# Altium project MGMEZZ04.PrjPCB (part 3 of 3)

## Sheet ADC.SchDoc
size Letter; Author: Adam Gilbert; CompanyName: McGill University; DrawnBy: Adam Gilbert; Organization: Altium Limited; Address1: McGill Cosmology; Address2: 3600 University Street; Address3: Montreal, Quebec; Address4: Canada; DocumentNumber: 5; Revision: Rev2; SheetNumber: 5; SheetTotal: 16; ProjectTitle: DfMux FMC Mezz; ModelNumber: MGMEZZ04; ProjectName: DfMux FMC Mezz
Used 2 times, as channels W12/DemodAB, W34/DemodAB. Parts and nets are listed once, with the designators drawn on the sheet.
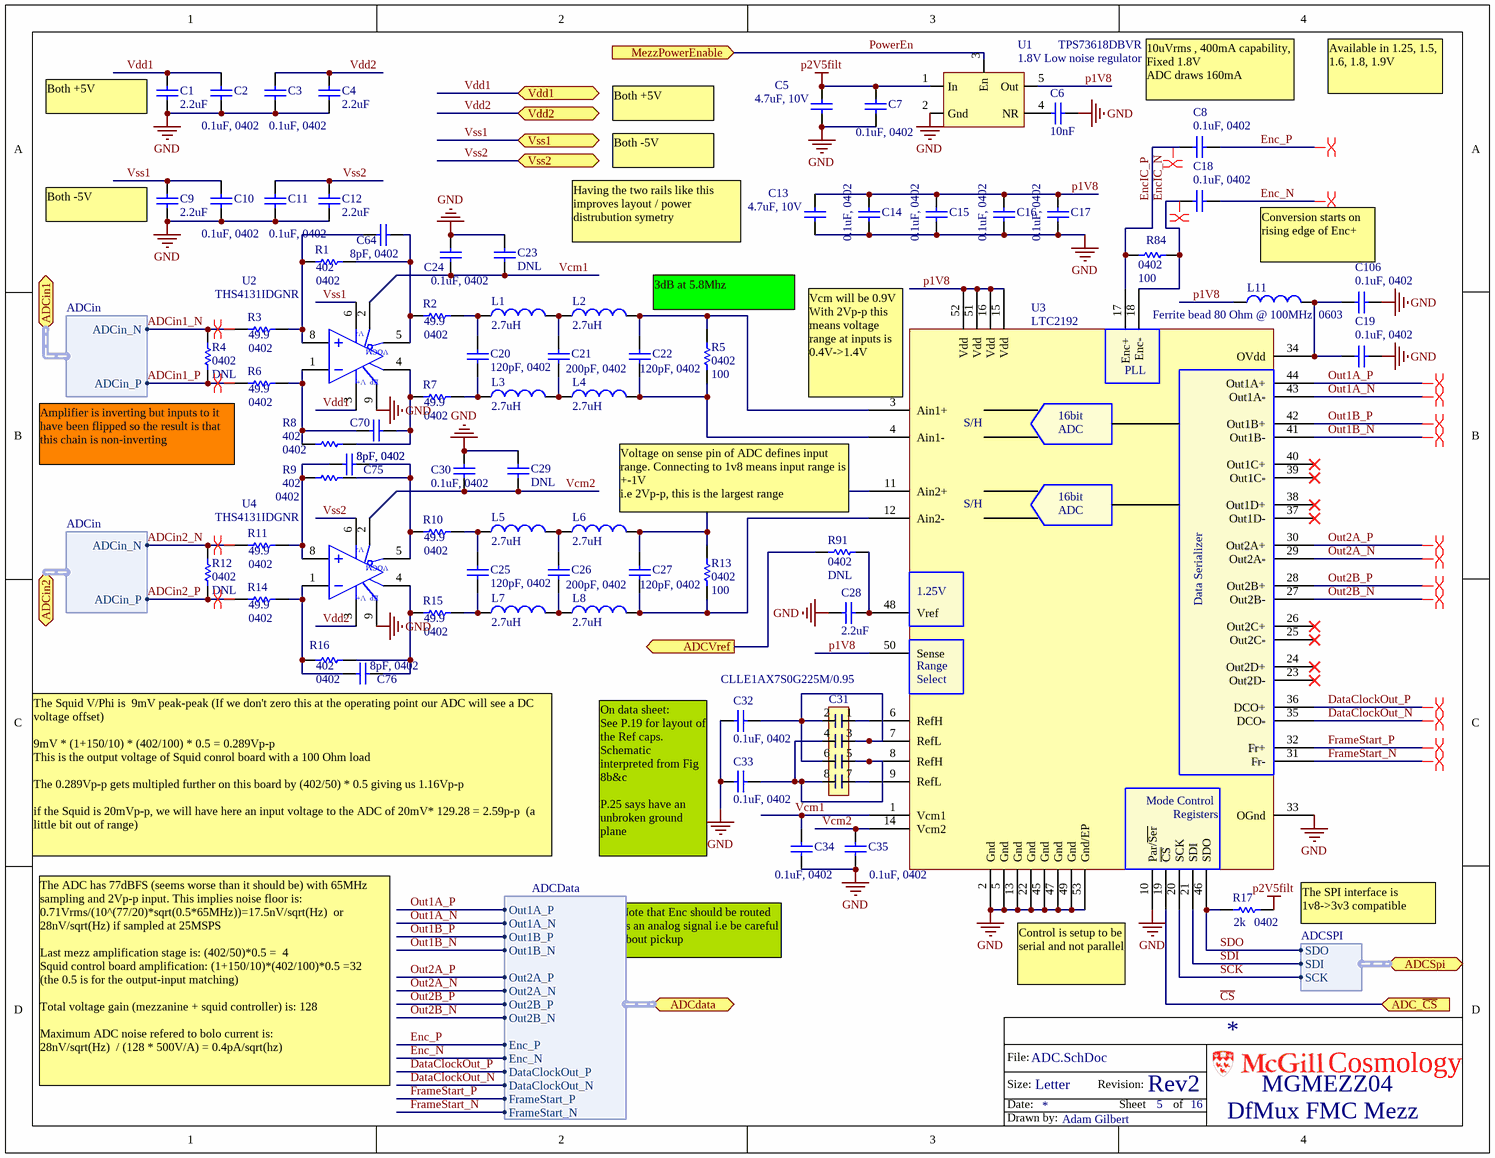
[diagram p12: ADC.SchDoc]

### Parts
C1  2.2uF  [0603]
C2  0.1uF, 0402  [0402]
C3  0.1uF, 0402  [0402]
C4  2.2uF  [0603]
C5  4.7uF, 10V  [0805]
C6  10nF  [0603]
C7  0.1uF, 0402  [0402]
C8  0.1uF, 0402  [0402]
C9  2.2uF  [0603]
C10  0.1uF, 0402  [0402]
C11  0.1uF, 0402  [0402]
C12  2.2uF  [0603]
C13  4.7uF, 10V  [0805]
C14  0.1uF, 0402  [0402]
C15  0.1uF, 0402  [0402]
C16  0.1uF, 0402  [0402]
C17  0.1uF, 0402  [0402]
C18  0.1uF, 0402  [0402]
C19  0.1uF, 0402  [0402]
C20  120pF, 0402  [0402]
C21  200pF, 0402  [0402]
C22  120pF, 0402  [0402]
C23  DNL  [0603]
C24  0.1uF, 0402  [0402]
C25  120pF, 0402  [0402]
C26  200pF, 0402  [0402]
C27  120pF, 0402  [0402]
C28  2.2uF  [0603]
C29  DNL  [0603]
C30  0.1uF, 0402  [0402]
C31  CLLE1AX7S0G225M/0.95  [CLLE1]
C32  0.1uF, 0402  [0402]
C33  0.1uF, 0402  [0402]
C34  0.1uF, 0402  [0402]
C35  0.1uF, 0402  [0402]
C64  8pF, 0402  [0402]
C70  8pF, 0402  [0402]
C75  8pF, 0402  [0402]
C76  8pF, 0402  [0402]
C106  0.1uF, 0402  [0402]
L1  2.7uH  [0603]
L2  2.7uH  [0603]
L3  2.7uH  [0603]
L4  2.7uH  [0603]
L5  2.7uH  [0603]
L6  2.7uH  [0603]
L7  2.7uH  [0603]
L8  2.7uH  [0603]
L11  Ferrite bead 80 Ohm @ 100MHz  0603  [0603]
R1  402  [0402]
R2  49.9  [0402]
R3  49.9  [0402]
R4  DNL  [0402]
R5  100  [0402]
R6  49.9  [0402]
R7  49.9  [0402]
R8  402  [0402]
R9  402  [0402]
R10  49.9  [0402]
R11  49.9  [0402]
R12  DNL  [0402]
R13  100  [0402]
R14  49.9  [0402]
R15  49.9  [0402]
R16  402  [0402]
R17  2k  [0402]
R84  100  [0402]
R91  DNL  [0402]
U1  1.8V Low noise regulator  [SOT23-5]
U2  THS4131IDGNR  [SOP8-EP-127P600-8N]
U3  LTC2192  [QFN50P800X700X80_HS-53N]
U4  THS4131IDGNR  [SOP8-EP-127P600-8N]

### Ports
ADC_~{CS} (in), ADCdata (harness ADCData), ADCin1 (harness ADCin), ADCin2 (harness ADCin), ADCSpi (harness ADCSPI), ADCVref (out), MezzPowerEnable (in), Vdd1, Vdd2, Vss1, Vss2

### Harnesses
ADCin: ADCin_P, ADCin_N
ADCSPI: SDO, SDI, SCK
ADCData: Enc_P, Enc_N, Out1A_P, Out1A_N, Out1B_P, Out1B_N, Out2A_P, Out2A_N, Out2B_P, Out2B_N, DataClockOut_P, DataClockOut_N, FrameStart_P, FrameStart_N

### Nets
GND: C1.2 C2.1 C3.1 C4.2 C5.1 C6.1 C7.1 C9.2 C10.1 C11.1 C12.2 C13.1 C14.1 C15.1 C16.1 C17.1 C19.2 C23.2 C24.1 C28.2 C29.2 C30.1 C32.1 C33.1 C34.2 C35.2 C106.2 U1.2(Gnd) U2.9(EP) U3.2(Gnd) U3.5(Gnd) U3.10(Par/~{Ser}) U3.13(Gnd) U3.22(Gnd) U3.33(OGnd) U3.45(Gnd) U3.47(Gnd) U3.49(Gnd) U3.53(Gnd/EP) U4.9(EP)
p2V5filt: C5.2 C7.2 R17.1 U1.1(In)
ADCin1_N: R3.1 R4.2 ; port ADCin1.ADCin_N
ADCin1_P: R4.1 R6.1 ; port ADCin1.ADCin_P
ADCin2_N: R11.1 R12.2 ; port ADCin2.ADCin_N
ADCin2_P: R12.1 R14.1 ; port ADCin2.ADCin_P
ADCVref: R91.2 ; port ADCVref
~{CS}: U3.19(~{CS}) ; port ADC_~{CS}
DataClockOut_N: U3.35(DCO-) ; port ADCdata.DataClockOut_N
DataClockOut_P: U3.36(DCO+) ; port ADCdata.DataClockOut_P
Enc_N: C18.2 ; port ADCdata.Enc_N
Enc_P: C8.2 ; port ADCdata.Enc_P
EncIC_N: C18.1 R84.1 U3.18(Enc-)
EncIC_P: C8.1 R84.2 U3.17(Enc+)
FrameStart_N: U3.31(Fr-) ; port ADCdata.FrameStart_N
FrameStart_P: U3.32(Fr+) ; port ADCdata.FrameStart_P
Out1A_N: U3.43(Out1A-) ; port ADCdata.Out1A_N
Out1A_P: U3.44(Out1A+) ; port ADCdata.Out1A_P
Out1B_N: U3.41(Out1B-) ; port ADCdata.Out1B_N
Out1B_P: U3.42(Out1B+) ; port ADCdata.Out1B_P
Out2A_N: U3.29(Out2A-) ; port ADCdata.Out2A_N
Out2A_P: U3.30(Out2A+) ; port ADCdata.Out2A_P
Out2B_N: U3.27(Out2B-) ; port ADCdata.Out2B_N
Out2B_P: U3.28(Out2B+) ; port ADCdata.Out2B_P
p1V8: C13.2 C14.2 C15.2 C16.2 C17.2 L11.1 U1.5(Out) U3.15(Vdd) U3.16(Vdd) U3.50(Sense) U3.51(Vdd) U3.52(Vdd)
PowerEn: U1.3(En) ; port MezzPowerEnable
SCK: U3.20(SCK) ; port ADCSpi.SCK
SDI: U3.21(SDI) ; port ADCSpi.SDI
SDO: R17.2 U3.46(SDO) ; port ADCSpi.SDO
Vcm1: C23.1 C24.2 C34.1 U2.2(VOCM) U3.1(Vcm1)
Vcm2: C29.1 C30.2 C35.1 U3.14(Vcm2) U4.2(VOCM)
Vdd1: C1.1 C2.2 U2.3(V+) ; port Vdd1
Vdd2: C3.2 C4.1 U4.3(V+) ; port Vdd2
Vss1: C9.1 C10.2 U2.6(V-) ; port Vss1
Vss2: C11.2 C12.1 U4.6(V-) ; port Vss2
NetC6_2: C6.2 U1.4(NR)
NetC19_1: C19.1 C106.1 L11.2 U3.34(OVdd)
NetC20_1: C20.1 L3.1 R7.2
NetC20_2: C20.2 L1.1 R2.2
NetC21_1: C21.1 L3.2 L4.1
NetC21_2: C21.2 L1.2 L2.1
NetC22_1: C22.1 L4.2 R5.1 U3.4(Ain1-)
NetC22_2: C22.2 L2.2 R5.2 U3.3(Ain1+)
NetC25_1: C25.1 L7.1 R15.2
NetC25_2: C25.2 L5.1 R10.2
NetC26_1: C26.1 L7.2 L8.1
NetC26_2: C26.2 L5.2 L6.1
NetC27_1: C27.1 L8.2 R13.1 U3.12(Ain2-)
NetC27_2: C27.2 L6.2 R13.2 U3.11(Ain2+)
NetC28_1: C28.1 R91.1 U3.48(Vref)
NetC31_1: C31.1 U3.6(RefH)
NetC31_2: C31.2 C31.3 C31.6 C32.2 U3.7(RefL)
NetC31_4: C31.4 C31.5 C31.8 C33.2 U3.8(RefH)
NetC31_7: C31.7 U3.9(RefL)
NetC64_1: C64.1 R1.2 R2.1 U2.5(OUT-)
NetC64_2: C64.2 R1.1 R3.2 U2.8(IN+)
NetC70_1: C70.1 R7.1 R8.2 U2.4(OUT+)
NetC70_2: C70.2 R6.2 R8.1 U2.1(IN-)
NetC75_1: C75.1 R9.2 R10.1 U4.5(OUT-)
NetC75_2: C75.2 R9.1 R11.2 U4.8(IN+)
NetC76_1: C76.1 R15.1 R16.2 U4.4(OUT+)
NetC76_2: C76.2 R14.2 R16.1 U4.1(IN-)

Not connected (* = marked no-connect by the designer): U2 7(NC); U3 23(Out2D-)* 24(Out2D+)* 25(Out2C-)* 26(Out2C+)* 37(Out1D-)* 38(Out1D+)* 39(Out1C-)* 40(Out1C+)*; U4 7(NC)

### Channels
W12/DemodAB: designators end in A; ports ADC_~{CS}=ADC_CS_Wire1 ADCVref=Vref MezzPowerEnable=MezzPowerEnable Vdd1=Vdd Vdd2=Vdd Vss1=Vss Vss2=Vss
W34/DemodAB: designators end in B; ports ADC_~{CS}=ADC_CS_Wire2 ADCVref=Vref MezzPowerEnable=MezzPowerEnable Vdd1=Vdd Vdd2=Vdd Vss1=Vss Vss2=Vss

### Layout directives
differential pair: ADCin1_N, ADCin1_P, ADCin2_N, ADCin2_P, CH12_ADC_DAT.DataClockOut_N, CH12_ADC_DAT.DataClockOut_P, CH12_ADC_DAT.Enc_N, CH12_ADC_DAT.Enc_P, CH12_ADC_DAT.FrameStart_N, CH12_ADC_DAT.FrameStart_P, CH12_ADC_DAT.Out1A_N, CH12_ADC_DAT.Out1A_P, CH12_ADC_DAT.Out1B_N, CH12_ADC_DAT.Out1B_P, CH12_ADC_DAT.Out2A_N, CH12_ADC_DAT.Out2A_P, CH12_ADC_DAT.Out2B_N, CH12_ADC_DAT.Out2B_P, EncIC_N_DemodAB, EncIC_P_DemodAB

### Notes on the sheet
- (near C8) 10uVrms , 400mA capability, Fixed 1.8V
  ADC draws 160mA
- Available in 1.25, 1.5, 1.6, 1.8, 1.9V
- (near C1) Both +5V
- Both +5V
- Both -5V
- (near C9) Both -5V
- Having the two rails like this improves layout / power distrubution symetry
- Conversion starts on rising edge of Enc+
- 3dB at 5.8Mhz
- (near U3) Vcm will be 0.9V
  With 2Vp-p this means voltage range at inputs is 0.4V->1.4V
- Amplifier is inverting but inputs to it have been flipped so the result is that this chain is non-inverting
- (near L6) Voltage on sense pin of ADC defines input range. Connecting to 1v8 means input range is +-1V
  i.e 2Vp-p, this is the largest range
- The Squid V/Phi is  9mV peak-peak (If we don't zero this at the operating point our ADC will see a DC voltage offset)
  9mV * (1+150/10) * (402/100) * 0.5 = 0.289Vp-p
  This is the output voltage of Squid conrol board with a 100 Ohm load
  The 0.289Vp-p gets multipled further on this board by (402/50) * 0.5 giving us 1.16Vp-p
  if the Squid is 20mVp-p, we will have here an input voltage to the ADC of 20mV* 129.28 = 2.59p-p  (a little bit out of range)
- On data sheet:
  See P.19 for layout of the Ref caps. Schematic interpreted from Fig 8b&c
  P.25 says have an unbroken ground plane
- (near C34) Note that Enc should be routed as an analog signal i.e be careful about pickup
- The SPI interface is 1v8->3v3 compatible
- Control is setup to be serial and not parallel
- The ADC has 77dBFS (seems worse than it should be) with 65MHz sampling and 2Vp-p input. This implies noise floor is: 0.71Vrms/(10^(77/20)*sqrt(0.5*65MHz))=17.5nV/sqrt(Hz)  or 28nV/sqrt(Hz) if sampled at 25MSPS
  Last mezz amplification stage is: (402/50)*0.5 =  4
  Squid control board amplification: (1+150/10)*(402/100)*0.5 =32
  (the 0.5 is for the output-input matching)
  Total voltage gain (mezzanine + squid controller) is: 128
  Maximum ADC noise refered to bolo current is:
  28nV/sqrt(Hz)  / (128 * 500V/A) = 0.4pA/sqrt(hz)
- File:
- Size:
- Date:
- Letter
- Revision:
- Sheet
- of
- Cosmology
- Drawn by:
- (in symbol LTC2192) PLL; 16bit; S/H; ADC; 1.25V; Data Serializer; Range; Select; Mode Control; Registers

### Library data of the parts
C1 C4 C9 C12 C23 C28 C29 = CAP 0603: Capacitor, Ceramic, 0603; Part Constraints: 10% 6.3V X5R 0603; Manufacturer: TDK Corporation; Manufacturer Part Number 1: C1608X5R0J225K080AB; Assembly Comments: none; Temperature Coefficient: X5R; Supplier 1: Digi-Key; Supplier Part Number 1: 445-5175-1-ND; Operating Temperature: -55°C ~ 85°C; Thickness (Max): 0.037" (0.95mm); Packaging: Cut Tape (CT)
  C1 C4 C9 C12 C28: Value: 2.2uF
  C23 C29: Value: DNL
C2 C3 C7 C8 C10 C11 C14-C19 C24 C30 C32-C35 C106 = CAP 0603: Capacitor, Ceramic, 0402; Part Constraints: 10% 10V X5R 0402; Manufacturer: TDK Corporation; Manufacturer Part Number 1: C1005X5R1A104K050BA; Temperature Coefficient: X5R; Assembly Comments: none; Value: 0.1uF, 0402; Supplier 1: Digi-Key; Supplier Part Number 1: 445-1265-1-ND; Operating Temperature: -55°C ~ 85°C; Thickness (Max): 0.022" (0.55mm); Packaging: Cut Tape (CT)
C5 C13 = CAP 0805: Capacitor, Ceramic, 0805; Manufacturer Part Number 1: LMK212BJ475KD-T; Manufacturer: Taiyo Yuden; Temperature Coefficient: X5R; Assembly Comments: none; Supplier 1: Digi-Key; Supplier Part Number 1: 587-1297-6-ND; Packaging: Digi-Reel®; Operating Temperature: -55°C ~ 85°C; Thickness (Max): 0.037" (0.95mm); Value: 4.7uF, 10V; Part Constraints: LMK212BJ475KD-T
C6 = CAP 0603: Capacitor, Ceramic, 0603; Part Constraints: 10% 16V X7R 0603; Manufacturer: Generic; Assembly Comments: none; Value: 10nF; Manufacturer Part Number 1: Generic
C20-C22 C25-C27 C64 C70 C75 C76 = CAP 0402: Capacitor, Ceramic, 0402; Part Constraints: 10% 16V X7R 0402; Manufacturer: Generic; Assembly Comments: none; Manufacturer Part Number 1: Generic
  C20 C22 C25 C27: Value: 120pF, 0402
  C21 C26: Value: 200pF, 0402
  C64 C70 C75 C76: Value: 8pF, 0402
C31 = CapArray0805: 2.2uFx4 4V 0805 Cap Array; Manufacturer: TDK Corporation; Temperature Coefficient: X7S; Assembly Comments: none; Supplier 1: Digi-Key; Manufacturer Part Number 1: CLLE1AX7S0G225M/0.95; Operating Temperature: -55°C ~ 125°C; Thickness (Max): 0.037" (0.95mm); Packaging: Cut Tape (CT); Supplier Part Number 1: 445-3406-1-ND; Part Constraints: CLLE1AX7S0G225M/0.95
L1-L8 = IND 0603: Inductor 0603; Manufacturer: TDK Corporation; Part Constraints: MLF1608A2R7K; Assembly Comments: none; Value: 2.7uH; Manufacturer Part Number 1: MLF1608A2R7K
L11 = IND 0603: Inductor 0603; Manufacturer: Abracon Corporation; Part Constraints: ACML-0603-800-T; Assembly Comments: none; Value: Ferrite bead 80 Ohm @ 100MHz  0603; Manufacturer Part Number 1: ACML-0603-800-T
R1-R17 R84 R91 = RES 0402: Resistor; Manufacturer: Generic; Part Constraints: 1% 1/10W 100ppm 0402; Assembly Comments: none; Manufacturer Part Number 1: Generic
  R1 R8 R9 R16: Value: 402
  R2 R3 R6 R7 R10 R11 R14 R15: Value: 49.9
  R4 R12 R91: Value: DNL
  R5 R13 R84: Value: 100
  R17: Value: 2k
U1 = TPS73618DBVR: Fixed 1.8V 10uVrms noise 400mA regulator; Manufacturer: Texas Instruments; Assembly Comments: none; Supplier 1: Digi-Key; Manufacturer Part Number 1: TPS73618DBVR; Operating Temperature: -40°C ~ 125°C; Packaging: Cut Tape (CT); Supplier Part Number 1: 296-27063-1-ND; Part Constraints: TPS73618DBVR
U2 U4 = THS4131IDGNR: IC OPAMP DIFF 225MHZ SGL 8MSOP; Manufacturer: Texas Instruments; Assembly Comments: none; Supplier 1: Digi-Key; Manufacturer Part Number 1: THS4131IDGNR; Operating Temperature: -40°C ~ 85°C; Packaging: Cut Tape (CT); Supplier Part Number 1: 296-10047-1-ND; Part Constraints: THS4131IDGNR
U3 = LTC2192: IC ADC 16BIT PAR/SRL 65MSP 52QFN; Manufacturer Part Number 1: LTC2192IUKG#PBF; Manufacturer: Linear Technology; Assembly Comments: none; Supplier 1: Digi-Key; Operating Temperature: -40°C ~ 85°C; Packaging: Tube; Supplier Part Number 1: LTC2192IUKG#PBF-ND; Part Constraints: LTC2192IUKG#PBF

## Sheet Mechanical.SchDoc
size Letter; Author: Adam Gilbert; CompanyName: McGill University; DrawnBy: Adam Gilbert; Organization: Altium Limited; Address1: McGill Cosmology; Address2: 3600 University Street; Address3: Montreal, Quebec; Address4: Canada; DocumentNumber: 15; Revision: Rev2; SheetNumber: 15; SheetTotal: 16; ProjectTitle: DfMux FMC Mezz; ModelNumber: MGMEZZ04; ProjectName: DfMux FMC Mezz
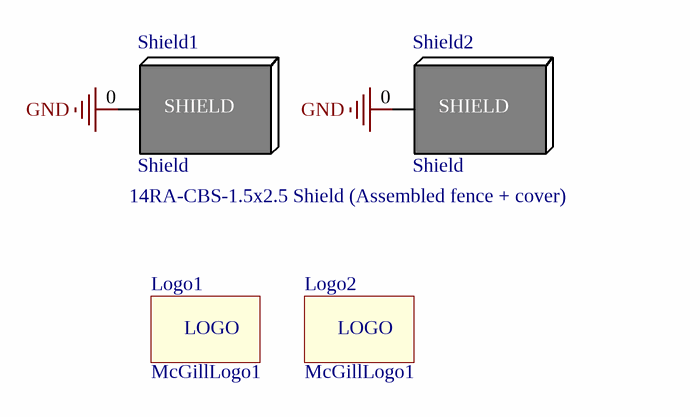
[diagram p13: Mechanical.SchDoc]

### Parts
Logo1  McGillLogo1  [McGillLogo1]  (no BOM)
Logo2  McGillLogo1  [McGillLogo1]  (no BOM)
Shield1  Shield  [14RA-CBS-1.5x2.5 Shield]
Shield2  Shield  [14RA-CBS-1.5x2.5 Shield]

### Nets
GND: Shield1.0(Ground) Shield2.0(Ground)

### Notes on the sheet
- File:
- Size:
- Date:
- Letter
- Revision:
- Sheet
- of
- Cosmology
- Drawn by:
- (in symbol 14RA-CBS-1.5x2.5) SHIELD

### Library data of the parts
Logo1 Logo2 = Logo: Assembly Comments: none
Shield1 Shield2 = 14RA-CBS-1.5x2.5: 14RA-CBS-1.5x2.5 Shield (Assembled fence + cover); Manufacturer: Leadertech; Assembly Comments: none; Supplier 1: Leadertech; Supplier Part Number 1: 14RA-CBS-1.5x2.5 Shield (Assembled fence + cover); Part Constraints: 14RA-CBS-1.5x2.5 Shield (Assembled fence + cover); Manufacturer Part Number 1: 14RA-CBS-1.5x2.5 Shield (Assembled fence + cover)

## Sheet TempSense.SchDoc
size Letter; Author: Adam Gilbert; CompanyName: McGill University; DrawnBy: Adam Gilbert; Organization: Altium Limited; Address1: McGill Cosmology; Address2: 3600 University Street; Address3: Montreal, Quebec; Address4: Canada; DocumentNumber: 10; Revision: Rev2; SheetNumber: 10; SheetTotal: 16; ProjectTitle: DfMux FMC Mezz; ModelNumber: MGMEZZ04; ProjectName: DfMux FMC Mezz
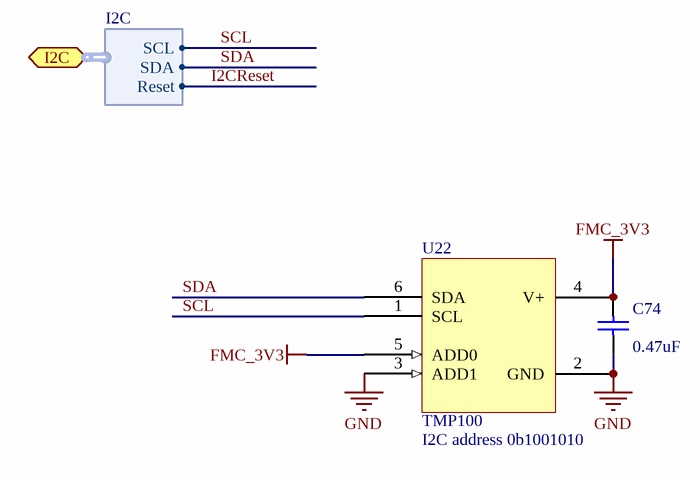
[diagram p14: TempSense.SchDoc]

### Parts
C74  0.47uF  [0402]
U22  TMP100  [SOT23-6]

### Ports
I2C (harness I2C)

### Harnesses
I2C: SCL, SDA, Reset

### Nets
FMC_3V3: C74.2 U22.4(V+) U22.5(ADD0)
GND: C74.1 U22.2(GND) U22.3(ADD1)
SCL: U22.1(SCL) ; port I2C.SCL  [project net I2C.SCL]
SDA: U22.6(SDA) ; port I2C.SDA  [project net I2C.SDA]

### Notes on the sheet
- (near U22) I2C address 0b1001010
- File:
- Size:
- Date:
- Letter
- Revision:
- Sheet
- of
- Cosmology
- Drawn by:

### Library data of the parts
C74 = Cap Semi: Capacitor (Semiconductor SIM Model); Manufacturer: e.g Taiyo Yuden; Part constraints: 0.47uF, 6.3V, 10%, X5R, 0402; Manufacturer Part Number 1: e.g JMK105BJ474KV-F; Assembly Comments: none; Value: 0.47uF; Supplier 1: Digikey; Supplier Part Number 1: 587-1230-1-ND
U22 = TMP100: Digital Temperature Sensor with I2C Interface; Part Constraints: TMP100NA; Manufacturer: Texas Instruments; Manufacturer Part Number 1: TMP100NA/3K; Assembly Comments: none; Operating Temperature: -55°C ~ 125°C; Packaging: Cut Tape (CT); Supplier 1: Digi-Key; Supplier Part Number 1: 296-26833-1-ND

## Nets that join several sheets
3V3AUX: FMCio_rowsCDGH (5 pins), FMCPower (P1.D32)
+5VD: FMCPower (5 pins), W12/DACNulCarA/Tr1 (6 pins), W12/DACNulCarB/Tr1 (6 pins), W34/DACNulCarA/Tr1 (6 pins), W34/DACNulCarB/Tr1 (6 pins)
FMC_2V5_ADJ: FMCio_rowsCDGH (R85.1), FMCPower (C100.1 Ip3.1 R73.2 R77.1), W12/DACNulCarA/Tr1 (8 pins), W12/DACNulCarB/Tr1 (8 pins), W34/DACNulCarA/Tr1 (8 pins), W34/DACNulCarB/Tr1 (8 pins)
FMC_3V3: FMCPower (6 pins), W12/DACNulCarA (5 pins), W12/DACNulCarB (5 pins), W34/DACNulCarA (5 pins), W34/DACNulCarB (5 pins), TempSense (C74.2 U22.4 U22.5)
FMC_12V: FMCPower (R48.1 R74.2 R78.2), U_FMCPower/BP (R58B.2), U_FMCPower/BN (R58A.2)
GND: MGMEZZ04 (15 pins), FMCio_rowsCDGH (C99.2 R25.2 R92.2 U15.4), FMCPower (182 pins), U_FMCPower/BP (C56B.2 C59B.1 R49B.2), U_FMCPower/BN (C56A.2 C59A.1 R51A.1), W12/DACNulCarA (14 pins), W12/DACNulCarA/N (22 pins), W12/DACNulCarA/N/PR (10 pins), W12/DACNulCarA/C (22 pins), W12/DACNulCarA/C/PR (10 pins), W12/DACNulCarA/Tr1 (18 pins), W12/DemodAB (40 pins), W12/DACNulCarB (14 pins), W12/DACNulCarB/N (22 pins), W12/DACNulCarB/N/PR (10 pins), W12/DACNulCarB/C (22 pins), W12/DACNulCarB/C/PR (10 pins), W12/DACNulCarB/Tr1 (18 pins), W34/DACNulCarA (14 pins), W34/DACNulCarA/N (22 pins), W34/DACNulCarA/N/PR (10 pins), W34/DACNulCarA/C (22 pins), W34/DACNulCarA/C/PR (10 pins), W34/DACNulCarA/Tr1 (18 pins), W34/DemodAB (40 pins), W34/DACNulCarB (14 pins), W34/DACNulCarB/N (22 pins), W34/DACNulCarB/N/PR (10 pins), W34/DACNulCarB/C (22 pins), W34/DACNulCarB/C/PR (10 pins), W34/DACNulCarB/Tr1 (18 pins), Mechanical (Shield1.0 Shield2.0), TempSense (C74.1 U22.2 U22.3)
n5V5filt: FMCPower (C82.1 DP3.2 L13.1), W12/DACNulCarA (5 pins), W12/DACNulCarB (5 pins), W34/DACNulCarA (5 pins), W34/DACNulCarB (5 pins)
N5V5int: FMCPower (7 pins), U_FMCPower/BN (R49A.2)
p2V5filt: MGMEZZ04 (8 pins), FMCPower (C101.1 C109.1 C111.1 L9.2), W12/DemodAB (C5A.2 C7A.2 R17A.1 U1A.1), W34/DemodAB (C5B.2 C7B.2 R17B.1 U1B.1)
p5V5filt: MGMEZZ04 (J2.2), FMCPower (5 pins), W12/DACNulCarA (C53A.2 U10A.1), W12/DACNulCarB (C53B.2 U10B.1), W34/DACNulCarA (C53C.2 U10C.1), W34/DACNulCarB (C53D.2 U10D.1)
P5V5int: FMCPower (8 pins), U_FMCPower/BP (R51B.1)
ADC_CS_Wire1: FMCio_rowsCDGH (P1.H38), W12/DemodAB (U3A.19)
ADC_CS_Wire2: FMCio_rowsCDGH (P1.H37), W34/DemodAB (U3B.19)
ADCin1_N: MGMEZZ04 (J2.9), W34/DemodAB (R3B.1 R4B.2)
ADCin1_N: MGMEZZ04 (J2.16), W12/DemodAB (R3A.1 R4A.2)
ADCin1_P: MGMEZZ04 (J2.28), W34/DemodAB (R4B.1 R6B.1)
ADCin1_P: MGMEZZ04 (J2.35), W12/DemodAB (R4A.1 R6A.1)
ADCin2_N: MGMEZZ04 (J2.6), W34/DemodAB (R11B.1 R12B.2)
ADCin2_N: MGMEZZ04 (J2.13), W12/DemodAB (R11A.1 R12A.2)
ADCin2_P: MGMEZZ04 (J2.25), W34/DemodAB (R12B.1 R14B.1)
ADCin2_P: MGMEZZ04 (J2.32), W12/DemodAB (R12A.1 R14A.1)
ADCSpi.SCK: FMCio_rowsCDGH (P1.G34), W12/DemodAB (U3A.20), W34/DemodAB (U3B.20)
ADCSpi.SDI: FMCio_rowsCDGH (P1.H34), W12/DemodAB (U3A.21), W34/DemodAB (U3B.21)
ADCSpi.SDO: FMCio_rowsCDGH (P1.G33), W12/DemodAB (R17A.2 U3A.46), W34/DemodAB (R17B.2 U3B.46)
BuckSync: FMCio_rowsCDGH (R36.2), FMCio_rowsEFJK (R60.2), FMCPower (R64.1 U14.2), U_FMCPower/BP (BuckSyncB.1 U12B.17)
BuckSyncInv: FMCPower (R52.1), U_FMCPower/BN (BuckSyncA.1 U12A.17)
CarrierClk_DACNulCarA: W12/DACNulCarA (R45A.2), W12/DACNulCarA/C (R34A.2 U5A.26)
CarrierClk_DACNulCarA: W34/DACNulCarA (R45C.2), W34/DACNulCarA/C (R34E.2 U5E.26)
CarrierClk_DACNulCarB: W12/DACNulCarB (R45B.2), W12/DACNulCarB/C (R34C.2 U5C.26)
CarrierClk_DACNulCarB: W34/DACNulCarB (R45D.2), W34/DACNulCarB/C (R34G.2 U5G.26)
CarSwitchCtrl.SwitchCtrl0_DACNulCarA: W12/DACNulCarA (U8A.7), W12/DACNulCarA/C/PR (U18A.14 U18A.15)
CarSwitchCtrl.SwitchCtrl0_DACNulCarA: W34/DACNulCarA (U8C.7), W34/DACNulCarA/C/PR (U18E.14 U18E.15)
CarSwitchCtrl.SwitchCtrl0_DACNulCarB: W12/DACNulCarB (U8B.7), W12/DACNulCarB/C/PR (U18C.14 U18C.15)
CarSwitchCtrl.SwitchCtrl0_DACNulCarB: W34/DACNulCarB (U8D.7), W34/DACNulCarB/C/PR (U18G.14 U18G.15)
CarSwitchCtrl.SwitchCtrl1_DACNulCarA: W12/DACNulCarA (U8A.8), W12/DACNulCarA/C/PR (U18A.6 U18A.7)
CarSwitchCtrl.SwitchCtrl1_DACNulCarA: W34/DACNulCarA (U8C.8), W34/DACNulCarA/C/PR (U18E.6 U18E.7)
CarSwitchCtrl.SwitchCtrl1_DACNulCarB: W12/DACNulCarB (U8B.8), W12/DACNulCarB/C/PR (U18C.6 U18C.7)
CarSwitchCtrl.SwitchCtrl1_DACNulCarB: W34/DACNulCarB (U8D.8), W34/DACNulCarB/C/PR (U18G.6 U18G.7)
CarSwitchCtrl.SwitchCtrl2_DACNulCarA: W12/DACNulCarA (U8A.9), W12/DACNulCarA/C/PR (U19A.14 U19A.15)
CarSwitchCtrl.SwitchCtrl2_DACNulCarA: W34/DACNulCarA (U8C.9), W34/DACNulCarA/C/PR (U19E.14 U19E.15)
CarSwitchCtrl.SwitchCtrl2_DACNulCarB: W12/DACNulCarB (U8B.9), W12/DACNulCarB/C/PR (U19C.14 U19C.15)
CarSwitchCtrl.SwitchCtrl2_DACNulCarB: W34/DACNulCarB (U8D.9), W34/DACNulCarB/C/PR (U19G.14 U19G.15)
CarSwitchCtrl.SwitchCtrl3_DACNulCarA: W12/DACNulCarA (U8A.10), W12/DACNulCarA/C/PR (U19A.6 U19A.7)
CarSwitchCtrl.SwitchCtrl3_DACNulCarA: W34/DACNulCarA (U8C.10), W34/DACNulCarA/C/PR (U19E.6 U19E.7)
CarSwitchCtrl.SwitchCtrl3_DACNulCarB: W12/DACNulCarB (U8B.10), W12/DACNulCarB/C/PR (U19C.6 U19C.7)
CarSwitchCtrl.SwitchCtrl3_DACNulCarB: W34/DACNulCarB (U8D.10), W34/DACNulCarB/C/PR (U19G.6 U19G.7)
CH1_DAC_CLK.CarDACClk_n: FMCio_rowsCDGH (P1.H14), W12/DACNulCarA (R46A.2 U9A.3)
CH1_DAC_CLK.CarDACClk_p: FMCio_rowsCDGH (P1.H13), W12/DACNulCarA (R46A.1 U9A.4)
CH1_DAC_CLK.NulDACClk_n: FMCio_rowsCDGH (P1.G13), W12/DACNulCarA (R44A.2 U9A.2)
CH1_DAC_CLK.NulDACClk_p: FMCio_rowsCDGH (P1.G12), W12/DACNulCarA (R44A.1 U9A.1)
CH1_NCDataIn0: FMCio_rowsCDGH (P1.C19), W12/DACNulCarA/Tr1 (U17A.26)
CH1_NCDataIn1: FMCio_rowsCDGH (P1.C18), W12/DACNulCarA/Tr1 (U17A.27)
CH1_NCDataIn2: FMCio_rowsCDGH (P1.H29), W12/DACNulCarA/Tr1 (U17A.29)
CH1_NCDataIn3: FMCio_rowsCDGH (P1.H28), W12/DACNulCarA/Tr1 (U17A.30)
CH1_NCDataIn4: FMCio_rowsCDGH (P1.H19), W12/DACNulCarA/Tr1 (U17A.32)
CH1_NCDataIn5: FMCio_rowsCDGH (P1.H20), W12/DACNulCarA/Tr1 (U17A.33)
CH1_NCDataIn6: FMCio_rowsCDGH (P1.G19), W12/DACNulCarA/Tr1 (U17A.35)
CH1_NCDataIn7: FMCio_rowsCDGH (P1.G18), W12/DACNulCarA/Tr1 (U17A.36)
CH1_NCDataIn8: FMCio_rowsCDGH (P1.H17), W12/DACNulCarA/Tr1 (U17A.37)
CH1_NCDataIn9: FMCio_rowsCDGH (P1.H16), W12/DACNulCarA/Tr1 (U17A.38)
CH1_NCDataIn10: FMCio_rowsCDGH (P1.G16), W12/DACNulCarA/Tr1 (U17A.40)
CH1_NCDataIn11: FMCio_rowsCDGH (P1.G15), W12/DACNulCarA/Tr1 (U17A.41)
CH1_NCDataIn12: FMCio_rowsCDGH (P1.D15), W12/DACNulCarA/Tr1 (U17A.43)
CH1_NCDataIn13: FMCio_rowsCDGH (P1.D14), W12/DACNulCarA/Tr1 (U17A.44)
CH1_NCDataIn14: FMCio_rowsCDGH (P1.C15), W12/DACNulCarA/Tr1 (U17A.46)
CH1_NCDataIn15: FMCio_rowsCDGH (P1.C14), W12/DACNulCarA/Tr1 (U17A.47)
CH2_DAC_CLK.CarDACClk_n: FMCio_rowsCDGH (P1.H23), W12/DACNulCarB (R46B.2 U9B.3)
CH2_DAC_CLK.CarDACClk_p: FMCio_rowsCDGH (P1.H22), W12/DACNulCarB (R46B.1 U9B.4)
CH2_DAC_CLK.NulDACClk_n: FMCio_rowsCDGH (P1.G22), W12/DACNulCarB (R44B.2 U9B.2)
CH2_DAC_CLK.NulDACClk_p: FMCio_rowsCDGH (P1.G21), W12/DACNulCarB (R44B.1 U9B.1)
CH2_NCDataIn0: FMCio_rowsCDGH (P1.H32), W12/DACNulCarB/Tr1 (U17B.26)
CH2_NCDataIn1: FMCio_rowsCDGH (P1.H31), W12/DACNulCarB/Tr1 (U17B.27)
CH2_NCDataIn2: FMCio_rowsCDGH (P1.C27), W12/DACNulCarB/Tr1 (U17B.29)
CH2_NCDataIn3: FMCio_rowsCDGH (P1.C26), W12/DACNulCarB/Tr1 (U17B.30)
CH2_NCDataIn4: FMCio_rowsCDGH (P1.D27), W12/DACNulCarB/Tr1 (U17B.32)
CH2_NCDataIn5: FMCio_rowsCDGH (P1.D26), W12/DACNulCarB/Tr1 (U17B.33)
CH2_NCDataIn6: FMCio_rowsCDGH (P1.G28), W12/DACNulCarB/Tr1 (U17B.35)
CH2_NCDataIn7: FMCio_rowsCDGH (P1.G27), W12/DACNulCarB/Tr1 (U17B.36)
CH2_NCDataIn8: FMCio_rowsCDGH (P1.H26), W12/DACNulCarB/Tr1 (U17B.37)
CH2_NCDataIn9: FMCio_rowsCDGH (P1.H25), W12/DACNulCarB/Tr1 (U17B.38)
CH2_NCDataIn10: FMCio_rowsCDGH (P1.G25), W12/DACNulCarB/Tr1 (U17B.40)
CH2_NCDataIn11: FMCio_rowsCDGH (P1.G24), W12/DACNulCarB/Tr1 (U17B.41)
CH2_NCDataIn12: FMCio_rowsCDGH (P1.D24), W12/DACNulCarB/Tr1 (U17B.43)
CH2_NCDataIn13: FMCio_rowsCDGH (P1.D23), W12/DACNulCarB/Tr1 (U17B.44)
CH2_NCDataIn14: FMCio_rowsCDGH (P1.D18), W12/DACNulCarB/Tr1 (U17B.46)
CH2_NCDataIn15: FMCio_rowsCDGH (P1.D17), W12/DACNulCarB/Tr1 (U17B.47)
CH3_DAC_BUS0: FMCio_rowsEFJK (P1.K11), U_FMCio_rowsEFJK/Dup1 (RT3B.8)
CH3_DAC_BUS1: FMCio_rowsEFJK (P1.K10), U_FMCio_rowsEFJK/Dup1 (RT3B.7)
CH3_DAC_BUS2: FMCio_rowsEFJK (P1.J10), U_FMCio_rowsEFJK/Dup1 (RT3B.6)
CH3_DAC_BUS3: FMCio_rowsEFJK (P1.J9), U_FMCio_rowsEFJK/Dup1 (RT3B.5)
CH3_DAC_BUS4: FMCio_rowsEFJK (P1.E7), U_FMCio_rowsEFJK/Dup1 (RT3B.4)
CH3_DAC_BUS5: FMCio_rowsEFJK (P1.E6), U_FMCio_rowsEFJK/Dup1 (RT3B.3)
CH3_DAC_BUS6: FMCio_rowsEFJK (P1.F7), U_FMCio_rowsEFJK/Dup1 (RT3B.2)
CH3_DAC_BUS7: FMCio_rowsEFJK (P1.F8), U_FMCio_rowsEFJK/Dup1 (RT3B.1)
CH3_DAC_BUS8: FMCio_rowsEFJK (P1.K8), U_FMCio_rowsEFJK/Dup1 (RT5B.8)
CH3_DAC_BUS9: FMCio_rowsEFJK (P1.K7), U_FMCio_rowsEFJK/Dup1 (RT5B.7)
CH3_DAC_BUS10: FMCio_rowsEFJK (P1.J7), U_FMCio_rowsEFJK/Dup1 (RT5B.6)
CH3_DAC_BUS11: FMCio_rowsEFJK (P1.J6), U_FMCio_rowsEFJK/Dup1 (RT5B.5)
CH3_DAC_BUS12: FMCio_rowsEFJK (P1.F5), U_FMCio_rowsEFJK/Dup1 (RT5B.4)
CH3_DAC_BUS13: FMCio_rowsEFJK (P1.F4), U_FMCio_rowsEFJK/Dup1 (RT5B.3)
CH3_DAC_BUS14: FMCio_rowsEFJK (P1.E3), U_FMCio_rowsEFJK/Dup1 (RT5B.2)
CH3_DAC_BUS15: FMCio_rowsEFJK (P1.E2), U_FMCio_rowsEFJK/Dup1 (RT5B.1)
CH3_DAC_BUS_DUP0: FMCio_rowsEFJK (P1.K29), U_FMCio_rowsEFJK/Dup1 (RT4B.1)
CH3_DAC_BUS_DUP1: FMCio_rowsEFJK (P1.K28), U_FMCio_rowsEFJK/Dup1 (RT4B.2)
CH3_DAC_BUS_DUP2: FMCio_rowsEFJK (P1.J28), U_FMCio_rowsEFJK/Dup1 (RT4B.3)
CH3_DAC_BUS_DUP3: FMCio_rowsEFJK (P1.J27), U_FMCio_rowsEFJK/Dup1 (RT4B.4)
CH3_DAC_BUS_DUP4: FMCio_rowsEFJK (P1.E24), U_FMCio_rowsEFJK/Dup1 (RT4B.5)
CH3_DAC_BUS_DUP5: FMCio_rowsEFJK (P1.E25), U_FMCio_rowsEFJK/Dup1 (RT4B.6)
CH3_DAC_BUS_DUP6: FMCio_rowsEFJK (P1.F26), U_FMCio_rowsEFJK/Dup1 (RT4B.7)
CH3_DAC_BUS_DUP7: FMCio_rowsEFJK (P1.F25), U_FMCio_rowsEFJK/Dup1 (RT4B.8)
CH3_DAC_BUS_DUP8: FMCio_rowsEFJK (P1.K26), U_FMCio_rowsEFJK/Dup1 (RT6B.1)
CH3_DAC_BUS_DUP9: FMCio_rowsEFJK (P1.K25), U_FMCio_rowsEFJK/Dup1 (RT6B.2)
CH3_DAC_BUS_DUP10: FMCio_rowsEFJK (P1.J25), U_FMCio_rowsEFJK/Dup1 (RT6B.3)
CH3_DAC_BUS_DUP11: FMCio_rowsEFJK (P1.J24), U_FMCio_rowsEFJK/Dup1 (RT6B.4)
CH3_DAC_BUS_DUP12: FMCio_rowsEFJK (P1.F23), U_FMCio_rowsEFJK/Dup1 (RT6B.5)
CH3_DAC_BUS_DUP13: FMCio_rowsEFJK (P1.F22), U_FMCio_rowsEFJK/Dup1 (RT6B.6)
CH3_DAC_BUS_DUP14: FMCio_rowsEFJK (P1.E22), U_FMCio_rowsEFJK/Dup1 (RT6B.7)
CH3_DAC_BUS_DUP15: FMCio_rowsEFJK (P1.E21), U_FMCio_rowsEFJK/Dup1 (RT6B.8)
CH3_DAC_CLK.CarDACClk_n: FMCio_rowsEFJK (P1.F14), W34/DACNulCarA (R46C.2 U9C.3)
CH3_DAC_CLK.CarDACClk_p: FMCio_rowsEFJK (P1.F13), W34/DACNulCarA (R46C.1 U9C.4)
CH3_DAC_CLK.NulDACClk_n: FMCio_rowsEFJK (P1.E13), W34/DACNulCarA (R44C.2 U9C.2)
CH3_DAC_CLK.NulDACClk_p: FMCio_rowsEFJK (P1.E12), W34/DACNulCarA (R44C.1 U9C.1)
CH3_NCDataIn0: U_FMCio_rowsEFJK/Dup1 (RT3B.9 RT4B.16), W34/DACNulCarA/Tr1 (U17C.26)
CH3_NCDataIn1: U_FMCio_rowsEFJK/Dup1 (RT3B.10 RT4B.15), W34/DACNulCarA/Tr1 (U17C.27)
CH3_NCDataIn2: U_FMCio_rowsEFJK/Dup1 (RT3B.11 RT4B.14), W34/DACNulCarA/Tr1 (U17C.29)
CH3_NCDataIn3: U_FMCio_rowsEFJK/Dup1 (RT3B.12 RT4B.13), W34/DACNulCarA/Tr1 (U17C.30)
CH3_NCDataIn4: U_FMCio_rowsEFJK/Dup1 (RT3B.13 RT4B.12), W34/DACNulCarA/Tr1 (U17C.32)
CH3_NCDataIn5: U_FMCio_rowsEFJK/Dup1 (RT3B.14 RT4B.11), W34/DACNulCarA/Tr1 (U17C.33)
CH3_NCDataIn6: U_FMCio_rowsEFJK/Dup1 (RT3B.15 RT4B.10), W34/DACNulCarA/Tr1 (U17C.35)
CH3_NCDataIn7: U_FMCio_rowsEFJK/Dup1 (RT3B.16 RT4B.9), W34/DACNulCarA/Tr1 (U17C.36)
CH3_NCDataIn8: U_FMCio_rowsEFJK/Dup1 (RT5B.9 RT6B.16), W34/DACNulCarA/Tr1 (U17C.37)
CH3_NCDataIn9: U_FMCio_rowsEFJK/Dup1 (RT5B.10 RT6B.15), W34/DACNulCarA/Tr1 (U17C.38)
CH3_NCDataIn10: U_FMCio_rowsEFJK/Dup1 (RT5B.11 RT6B.14), W34/DACNulCarA/Tr1 (U17C.40)
CH3_NCDataIn11: U_FMCio_rowsEFJK/Dup1 (RT5B.12 RT6B.13), W34/DACNulCarA/Tr1 (U17C.41)
CH3_NCDataIn12: U_FMCio_rowsEFJK/Dup1 (RT5B.13 RT6B.12), W34/DACNulCarA/Tr1 (U17C.43)
CH3_NCDataIn13: U_FMCio_rowsEFJK/Dup1 (RT5B.14 RT6B.11), W34/DACNulCarA/Tr1 (U17C.44)
CH3_NCDataIn14: U_FMCio_rowsEFJK/Dup1 (RT5B.15 RT6B.10), W34/DACNulCarA/Tr1 (U17C.46)
CH3_NCDataIn15: U_FMCio_rowsEFJK/Dup1 (RT5B.16 RT6B.9), W34/DACNulCarA/Tr1 (U17C.47)
CH4_DAC_BUS0: FMCio_rowsEFJK (P1.K23), U_FMCio_rowsEFJK/Dup2 (RT3A.8)
CH4_DAC_BUS1: FMCio_rowsEFJK (P1.K22), U_FMCio_rowsEFJK/Dup2 (RT3A.7)
CH4_DAC_BUS2: FMCio_rowsEFJK (P1.J22), U_FMCio_rowsEFJK/Dup2 (RT3A.6)
CH4_DAC_BUS3: FMCio_rowsEFJK (P1.J21), U_FMCio_rowsEFJK/Dup2 (RT3A.5)
CH4_DAC_BUS4: FMCio_rowsEFJK (P1.K20), U_FMCio_rowsEFJK/Dup2 (RT3A.4)
CH4_DAC_BUS5: FMCio_rowsEFJK (P1.K19), U_FMCio_rowsEFJK/Dup2 (RT3A.3)
CH4_DAC_BUS6: FMCio_rowsEFJK (P1.E18), U_FMCio_rowsEFJK/Dup2 (RT3A.2)
CH4_DAC_BUS7: FMCio_rowsEFJK (P1.E19), U_FMCio_rowsEFJK/Dup2 (RT3A.1)
CH4_DAC_BUS8: FMCio_rowsEFJK (P1.J19), U_FMCio_rowsEFJK/Dup2 (RT5A.8)
CH4_DAC_BUS9: FMCio_rowsEFJK (P1.J18), U_FMCio_rowsEFJK/Dup2 (RT5A.7)
CH4_DAC_BUS10: FMCio_rowsEFJK (P1.K17), U_FMCio_rowsEFJK/Dup2 (RT5A.6)
CH4_DAC_BUS11: FMCio_rowsEFJK (P1.K16), U_FMCio_rowsEFJK/Dup2 (RT5A.5)
CH4_DAC_BUS12: FMCio_rowsEFJK (P1.F20), U_FMCio_rowsEFJK/Dup2 (RT5A.4)
CH4_DAC_BUS13: FMCio_rowsEFJK (P1.F19), U_FMCio_rowsEFJK/Dup2 (RT5A.3)
CH4_DAC_BUS14: FMCio_rowsEFJK (P1.E15), U_FMCio_rowsEFJK/Dup2 (RT5A.2)
CH4_DAC_BUS15: FMCio_rowsEFJK (P1.E16), U_FMCio_rowsEFJK/Dup2 (RT5A.1)
CH4_DAC_BUS_DUP0: FMCio_rowsEFJK (P1.K35), U_FMCio_rowsEFJK/Dup2 (RT4A.1)
CH4_DAC_BUS_DUP1: FMCio_rowsEFJK (P1.K34), U_FMCio_rowsEFJK/Dup2 (RT4A.2)
CH4_DAC_BUS_DUP2: FMCio_rowsEFJK (P1.J34), U_FMCio_rowsEFJK/Dup2 (RT4A.3)
CH4_DAC_BUS_DUP3: FMCio_rowsEFJK (P1.J33), U_FMCio_rowsEFJK/Dup2 (RT4A.4)
CH4_DAC_BUS_DUP4: FMCio_rowsEFJK (P1.F32), U_FMCio_rowsEFJK/Dup2 (RT4A.5)
CH4_DAC_BUS_DUP5: FMCio_rowsEFJK (P1.F31), U_FMCio_rowsEFJK/Dup2 (RT4A.6)
CH4_DAC_BUS_DUP6: FMCio_rowsEFJK (P1.E31), U_FMCio_rowsEFJK/Dup2 (RT4A.7)
CH4_DAC_BUS_DUP7: FMCio_rowsEFJK (P1.E30), U_FMCio_rowsEFJK/Dup2 (RT4A.8)
CH4_DAC_BUS_DUP8: FMCio_rowsEFJK (P1.J30), U_FMCio_rowsEFJK/Dup2 (RT6A.1)
CH4_DAC_BUS_DUP9: FMCio_rowsEFJK (P1.J31), U_FMCio_rowsEFJK/Dup2 (RT6A.2)
CH4_DAC_BUS_DUP10: FMCio_rowsEFJK (P1.E27), U_FMCio_rowsEFJK/Dup2 (RT6A.3)
CH4_DAC_BUS_DUP11: FMCio_rowsEFJK (P1.E28), U_FMCio_rowsEFJK/Dup2 (RT6A.4)
CH4_DAC_BUS_DUP12: FMCio_rowsEFJK (P1.F28), U_FMCio_rowsEFJK/Dup2 (RT6A.5)
CH4_DAC_BUS_DUP13: FMCio_rowsEFJK (P1.F29), U_FMCio_rowsEFJK/Dup2 (RT6A.6)
CH4_DAC_BUS_DUP14: FMCio_rowsEFJK (P1.K31), U_FMCio_rowsEFJK/Dup2 (RT6A.7)
CH4_DAC_BUS_DUP15: FMCio_rowsEFJK (P1.K32), U_FMCio_rowsEFJK/Dup2 (RT6A.8)
CH4_DAC_CLK.CarDACClk_n: FMCio_rowsEFJK (P1.J16), W34/DACNulCarB (R46D.2 U9D.3)
CH4_DAC_CLK.CarDACClk_p: FMCio_rowsEFJK (P1.J15), W34/DACNulCarB (R46D.1 U9D.4)
CH4_DAC_CLK.NulDACClk_n: FMCio_rowsEFJK (P1.F17), W34/DACNulCarB (R44D.2 U9D.2)
CH4_DAC_CLK.NulDACClk_p: FMCio_rowsEFJK (P1.F16), W34/DACNulCarB (R44D.1 U9D.1)
CH4_NCDataIn0: U_FMCio_rowsEFJK/Dup2 (RT3A.9 RT4A.16), W34/DACNulCarB/Tr1 (U17D.26)
CH4_NCDataIn1: U_FMCio_rowsEFJK/Dup2 (RT3A.10 RT4A.15), W34/DACNulCarB/Tr1 (U17D.27)
CH4_NCDataIn2: U_FMCio_rowsEFJK/Dup2 (RT3A.11 RT4A.14), W34/DACNulCarB/Tr1 (U17D.29)
CH4_NCDataIn3: U_FMCio_rowsEFJK/Dup2 (RT3A.12 RT4A.13), W34/DACNulCarB/Tr1 (U17D.30)
CH4_NCDataIn4: U_FMCio_rowsEFJK/Dup2 (RT3A.13 RT4A.12), W34/DACNulCarB/Tr1 (U17D.32)
CH4_NCDataIn5: U_FMCio_rowsEFJK/Dup2 (RT3A.14 RT4A.11), W34/DACNulCarB/Tr1 (U17D.33)
CH4_NCDataIn6: U_FMCio_rowsEFJK/Dup2 (RT3A.15 RT4A.10), W34/DACNulCarB/Tr1 (U17D.35)
CH4_NCDataIn7: U_FMCio_rowsEFJK/Dup2 (RT3A.16 RT4A.9), W34/DACNulCarB/Tr1 (U17D.36)
CH4_NCDataIn8: U_FMCio_rowsEFJK/Dup2 (RT5A.9 RT6A.16), W34/DACNulCarB/Tr1 (U17D.37)
CH4_NCDataIn9: U_FMCio_rowsEFJK/Dup2 (RT5A.10 RT6A.15), W34/DACNulCarB/Tr1 (U17D.38)
CH4_NCDataIn10: U_FMCio_rowsEFJK/Dup2 (RT5A.11 RT6A.14), W34/DACNulCarB/Tr1 (U17D.40)
CH4_NCDataIn11: U_FMCio_rowsEFJK/Dup2 (RT5A.12 RT6A.13), W34/DACNulCarB/Tr1 (U17D.41)
CH4_NCDataIn12: U_FMCio_rowsEFJK/Dup2 (RT5A.13 RT6A.12), W34/DACNulCarB/Tr1 (U17D.43)
CH4_NCDataIn13: U_FMCio_rowsEFJK/Dup2 (RT5A.14 RT6A.11), W34/DACNulCarB/Tr1 (U17D.44)
CH4_NCDataIn14: U_FMCio_rowsEFJK/Dup2 (RT5A.15 RT6A.10), W34/DACNulCarB/Tr1 (U17D.46)
CH4_NCDataIn15: U_FMCio_rowsEFJK/Dup2 (RT5A.16 RT6A.9), W34/DACNulCarB/Tr1 (U17D.47)
CH12_ADC_DAT.DataClockOut_N: FMCio_rowsCDGH (P1.D9), W12/DemodAB (U3A.35)
CH12_ADC_DAT.DataClockOut_P: FMCio_rowsCDGH (P1.D8), W12/DemodAB (U3A.36)
CH12_ADC_DAT.Enc_N: FMCio_rowsCDGH (P1.G7), W12/DemodAB (C18A.2)
CH12_ADC_DAT.Enc_P: FMCio_rowsCDGH (P1.G6), W12/DemodAB (C8A.2)
CH12_ADC_DAT.FrameStart_N: FMCio_rowsCDGH (P1.H11), W12/DemodAB (U3A.31)
CH12_ADC_DAT.FrameStart_P: FMCio_rowsCDGH (P1.H10), W12/DemodAB (U3A.32)
CH12_ADC_DAT.Out1A_N: FMCio_rowsCDGH (P1.D12), W12/DemodAB (U3A.43)
CH12_ADC_DAT.Out1A_P: FMCio_rowsCDGH (P1.D11), W12/DemodAB (U3A.44)
CH12_ADC_DAT.Out1B_N: FMCio_rowsCDGH (P1.C11), W12/DemodAB (U3A.41)
CH12_ADC_DAT.Out1B_P: FMCio_rowsCDGH (P1.C10), W12/DemodAB (U3A.42)
CH12_ADC_DAT.Out2A_N: FMCio_rowsCDGH (P1.G10), W12/DemodAB (U3A.29)
CH12_ADC_DAT.Out2A_P: FMCio_rowsCDGH (P1.G9), W12/DemodAB (U3A.30)
CH12_ADC_DAT.Out2B_N: FMCio_rowsCDGH (P1.H8), W12/DemodAB (U3A.27)
CH12_ADC_DAT.Out2B_P: FMCio_rowsCDGH (P1.H7), W12/DemodAB (U3A.28)
CH34_ADC_DAT.DataClockOut_N: FMCio_rowsCDGH (P1.D21), W34/DemodAB (U3B.35)
CH34_ADC_DAT.DataClockOut_P: FMCio_rowsCDGH (P1.D20), W34/DemodAB (U3B.36)
CH34_ADC_DAT.Enc_N: FMCio_rowsCDGH (P1.C23), W34/DemodAB (C18B.2)
CH34_ADC_DAT.Enc_P: FMCio_rowsCDGH (P1.C22), W34/DemodAB (C8B.2)
CH34_ADC_DAT.FrameStart_N: FMCio_rowsEFJK (P1.J13), W34/DemodAB (U3B.31)
CH34_ADC_DAT.FrameStart_P: FMCio_rowsEFJK (P1.J12), W34/DemodAB (U3B.32)
CH34_ADC_DAT.Out1A_N: FMCio_rowsEFJK (P1.E10), W34/DemodAB (U3B.43)
CH34_ADC_DAT.Out1A_P: FMCio_rowsEFJK (P1.E9), W34/DemodAB (U3B.44)
CH34_ADC_DAT.Out1B_N: FMCio_rowsEFJK (P1.K14), W34/DemodAB (U3B.41)
CH34_ADC_DAT.Out1B_P: FMCio_rowsEFJK (P1.K13), W34/DemodAB (U3B.42)
CH34_ADC_DAT.Out2A_N: FMCio_rowsEFJK (P1.F11), W34/DemodAB (U3B.29)
CH34_ADC_DAT.Out2A_P: FMCio_rowsEFJK (P1.F10), W34/DemodAB (U3B.30)
CH34_ADC_DAT.Out2B_N: FMCio_rowsEFJK (P1.K5), W34/DemodAB (U3B.27)
CH34_ADC_DAT.Out2B_P: FMCio_rowsEFJK (P1.K4), W34/DemodAB (U3B.28)
CO.DACout_N: MGMEZZ04 (J2.8), W34/DACNulCarB/C (R29G.2)
CO.DACout_N: MGMEZZ04 (J2.11), W34/DACNulCarA/C (R29E.2)
CO.DACout_N: MGMEZZ04 (J2.15), W12/DACNulCarB/C (R29C.2)
CO.DACout_N: MGMEZZ04 (J2.18), W12/DACNulCarA/C (R29A.2)
CO.DACout_P: MGMEZZ04 (J2.27), W34/DACNulCarB/C (R24G.2)
CO.DACout_P: MGMEZZ04 (J2.30), W34/DACNulCarA/C (R24E.2)
CO.DACout_P: MGMEZZ04 (J2.34), W12/DACNulCarB/C (R24C.2)
CO.DACout_P: MGMEZZ04 (J2.37), W12/DACNulCarA/C (R24A.2)
DACdataNC0_DACNulCarA: W12/DACNulCarA/N (U5B.14), W12/DACNulCarA/C (U5A.14), W12/DACNulCarA/Tr1 (RT2A.16)
DACdataNC0_DACNulCarA: W34/DACNulCarA/N (U5F.14), W34/DACNulCarA/C (U5E.14), W34/DACNulCarA/Tr1 (RT2C.16)
DACdataNC0_DACNulCarB: W12/DACNulCarB/N (U5D.14), W12/DACNulCarB/C (U5C.14), W12/DACNulCarB/Tr1 (RT2B.16)
DACdataNC0_DACNulCarB: W34/DACNulCarB/N (U5H.14), W34/DACNulCarB/C (U5G.14), W34/DACNulCarB/Tr1 (RT2D.16)
DACdataNC1_DACNulCarA: W12/DACNulCarA/N (U5B.13), W12/DACNulCarA/C (U5A.13), W12/DACNulCarA/Tr1 (RT2A.15)
DACdataNC1_DACNulCarA: W34/DACNulCarA/N (U5F.13), W34/DACNulCarA/C (U5E.13), W34/DACNulCarA/Tr1 (RT2C.15)
DACdataNC1_DACNulCarB: W12/DACNulCarB/N (U5D.13), W12/DACNulCarB/C (U5C.13), W12/DACNulCarB/Tr1 (RT2B.15)
DACdataNC1_DACNulCarB: W34/DACNulCarB/N (U5H.13), W34/DACNulCarB/C (U5G.13), W34/DACNulCarB/Tr1 (RT2D.15)
DACdataNC2_DACNulCarA: W12/DACNulCarA/N (U5B.12), W12/DACNulCarA/C (U5A.12), W12/DACNulCarA/Tr1 (RT2A.14)
DACdataNC2_DACNulCarA: W34/DACNulCarA/N (U5F.12), W34/DACNulCarA/C (U5E.12), W34/DACNulCarA/Tr1 (RT2C.14)
DACdataNC2_DACNulCarB: W12/DACNulCarB/N (U5D.12), W12/DACNulCarB/C (U5C.12), W12/DACNulCarB/Tr1 (RT2B.14)
DACdataNC2_DACNulCarB: W34/DACNulCarB/N (U5H.12), W34/DACNulCarB/C (U5G.12), W34/DACNulCarB/Tr1 (RT2D.14)
DACdataNC3_DACNulCarA: W12/DACNulCarA/N (U5B.11), W12/DACNulCarA/C (U5A.11), W12/DACNulCarA/Tr1 (RT2A.13)
DACdataNC3_DACNulCarA: W34/DACNulCarA/N (U5F.11), W34/DACNulCarA/C (U5E.11), W34/DACNulCarA/Tr1 (RT2C.13)
DACdataNC3_DACNulCarB: W12/DACNulCarB/N (U5D.11), W12/DACNulCarB/C (U5C.11), W12/DACNulCarB/Tr1 (RT2B.13)
DACdataNC3_DACNulCarB: W34/DACNulCarB/N (U5H.11), W34/DACNulCarB/C (U5G.11), W34/DACNulCarB/Tr1 (RT2D.13)
DACdataNC4_DACNulCarA: W12/DACNulCarA/N (U5B.10), W12/DACNulCarA/C (U5A.10), W12/DACNulCarA/Tr1 (RT2A.12)
DACdataNC4_DACNulCarA: W34/DACNulCarA/N (U5F.10), W34/DACNulCarA/C (U5E.10), W34/DACNulCarA/Tr1 (RT2C.12)
DACdataNC4_DACNulCarB: W12/DACNulCarB/N (U5D.10), W12/DACNulCarB/C (U5C.10), W12/DACNulCarB/Tr1 (RT2B.12)
DACdataNC4_DACNulCarB: W34/DACNulCarB/N (U5H.10), W34/DACNulCarB/C (U5G.10), W34/DACNulCarB/Tr1 (RT2D.12)
DACdataNC5_DACNulCarA: W12/DACNulCarA/N (U5B.9), W12/DACNulCarA/C (U5A.9), W12/DACNulCarA/Tr1 (RT2A.11)
DACdataNC5_DACNulCarA: W34/DACNulCarA/N (U5F.9), W34/DACNulCarA/C (U5E.9), W34/DACNulCarA/Tr1 (RT2C.11)
DACdataNC5_DACNulCarB: W12/DACNulCarB/N (U5D.9), W12/DACNulCarB/C (U5C.9), W12/DACNulCarB/Tr1 (RT2B.11)
DACdataNC5_DACNulCarB: W34/DACNulCarB/N (U5H.9), W34/DACNulCarB/C (U5G.9), W34/DACNulCarB/Tr1 (RT2D.11)
DACdataNC6_DACNulCarA: W12/DACNulCarA/N (U5B.8), W12/DACNulCarA/C (U5A.8), W12/DACNulCarA/Tr1 (RT2A.10)
DACdataNC6_DACNulCarA: W34/DACNulCarA/N (U5F.8), W34/DACNulCarA/C (U5E.8), W34/DACNulCarA/Tr1 (RT2C.10)
DACdataNC6_DACNulCarB: W12/DACNulCarB/N (U5D.8), W12/DACNulCarB/C (U5C.8), W12/DACNulCarB/Tr1 (RT2B.10)
DACdataNC6_DACNulCarB: W34/DACNulCarB/N (U5H.8), W34/DACNulCarB/C (U5G.8), W34/DACNulCarB/Tr1 (RT2D.10)
DACdataNC7_DACNulCarA: W12/DACNulCarA/N (U5B.7), W12/DACNulCarA/C (U5A.7), W12/DACNulCarA/Tr1 (RT2A.9)
DACdataNC7_DACNulCarA: W34/DACNulCarA/N (U5F.7), W34/DACNulCarA/C (U5E.7), W34/DACNulCarA/Tr1 (RT2C.9)
DACdataNC7_DACNulCarB: W12/DACNulCarB/N (U5D.7), W12/DACNulCarB/C (U5C.7), W12/DACNulCarB/Tr1 (RT2B.9)
DACdataNC7_DACNulCarB: W34/DACNulCarB/N (U5H.7), W34/DACNulCarB/C (U5G.7), W34/DACNulCarB/Tr1 (RT2D.9)
DACdataNC8_DACNulCarA: W12/DACNulCarA/N (U5B.6), W12/DACNulCarA/C (U5A.6), W12/DACNulCarA/Tr1 (RT1A.16)
DACdataNC8_DACNulCarA: W34/DACNulCarA/N (U5F.6), W34/DACNulCarA/C (U5E.6), W34/DACNulCarA/Tr1 (RT1C.16)
DACdataNC8_DACNulCarB: W12/DACNulCarB/N (U5D.6), W12/DACNulCarB/C (U5C.6), W12/DACNulCarB/Tr1 (RT1B.16)
DACdataNC8_DACNulCarB: W34/DACNulCarB/N (U5H.6), W34/DACNulCarB/C (U5G.6), W34/DACNulCarB/Tr1 (RT1D.16)
DACdataNC9_DACNulCarA: W12/DACNulCarA/N (U5B.5), W12/DACNulCarA/C (U5A.5), W12/DACNulCarA/Tr1 (RT1A.15)
DACdataNC9_DACNulCarA: W34/DACNulCarA/N (U5F.5), W34/DACNulCarA/C (U5E.5), W34/DACNulCarA/Tr1 (RT1C.15)
DACdataNC9_DACNulCarB: W12/DACNulCarB/N (U5D.5), W12/DACNulCarB/C (U5C.5), W12/DACNulCarB/Tr1 (RT1B.15)
DACdataNC9_DACNulCarB: W34/DACNulCarB/N (U5H.5), W34/DACNulCarB/C (U5G.5), W34/DACNulCarB/Tr1 (RT1D.15)
DACdataNC10_DACNulCarA: W12/DACNulCarA/N (U5B.4), W12/DACNulCarA/C (U5A.4), W12/DACNulCarA/Tr1 (RT1A.14)
DACdataNC10_DACNulCarA: W34/DACNulCarA/N (U5F.4), W34/DACNulCarA/C (U5E.4), W34/DACNulCarA/Tr1 (RT1C.14)
DACdataNC10_DACNulCarB: W12/DACNulCarB/N (U5D.4), W12/DACNulCarB/C (U5C.4), W12/DACNulCarB/Tr1 (RT1B.14)
DACdataNC10_DACNulCarB: W34/DACNulCarB/N (U5H.4), W34/DACNulCarB/C (U5G.4), W34/DACNulCarB/Tr1 (RT1D.14)
DACdataNC11_DACNulCarA: W12/DACNulCarA/N (U5B.3), W12/DACNulCarA/C (U5A.3), W12/DACNulCarA/Tr1 (RT1A.13)
DACdataNC11_DACNulCarA: W34/DACNulCarA/N (U5F.3), W34/DACNulCarA/C (U5E.3), W34/DACNulCarA/Tr1 (RT1C.13)
DACdataNC11_DACNulCarB: W12/DACNulCarB/N (U5D.3), W12/DACNulCarB/C (U5C.3), W12/DACNulCarB/Tr1 (RT1B.13)
DACdataNC11_DACNulCarB: W34/DACNulCarB/N (U5H.3), W34/DACNulCarB/C (U5G.3), W34/DACNulCarB/Tr1 (RT1D.13)
DACdataNC12_DACNulCarA: W12/DACNulCarA/N (U5B.2), W12/DACNulCarA/C (U5A.2), W12/DACNulCarA/Tr1 (RT1A.12)
DACdataNC12_DACNulCarA: W34/DACNulCarA/N (U5F.2), W34/DACNulCarA/C (U5E.2), W34/DACNulCarA/Tr1 (RT1C.12)
DACdataNC12_DACNulCarB: W12/DACNulCarB/N (U5D.2), W12/DACNulCarB/C (U5C.2), W12/DACNulCarB/Tr1 (RT1B.12)
DACdataNC12_DACNulCarB: W34/DACNulCarB/N (U5H.2), W34/DACNulCarB/C (U5G.2), W34/DACNulCarB/Tr1 (RT1D.12)
DACdataNC13_DACNulCarA: W12/DACNulCarA/N (U5B.1), W12/DACNulCarA/C (U5A.1), W12/DACNulCarA/Tr1 (RT1A.11)
DACdataNC13_DACNulCarA: W34/DACNulCarA/N (U5F.1), W34/DACNulCarA/C (U5E.1), W34/DACNulCarA/Tr1 (RT1C.11)
DACdataNC13_DACNulCarB: W12/DACNulCarB/N (U5D.1), W12/DACNulCarB/C (U5C.1), W12/DACNulCarB/Tr1 (RT1B.11)
DACdataNC13_DACNulCarB: W34/DACNulCarB/N (U5H.1), W34/DACNulCarB/C (U5G.1), W34/DACNulCarB/Tr1 (RT1D.11)
DACdataNC14_DACNulCarA: W12/DACNulCarA/N (U5B.28), W12/DACNulCarA/C (U5A.28), W12/DACNulCarA/Tr1 (RT1A.10)
DACdataNC14_DACNulCarA: W34/DACNulCarA/N (U5F.28), W34/DACNulCarA/C (U5E.28), W34/DACNulCarA/Tr1 (RT1C.10)
DACdataNC14_DACNulCarB: W12/DACNulCarB/N (U5D.28), W12/DACNulCarB/C (U5C.28), W12/DACNulCarB/Tr1 (RT1B.10)
DACdataNC14_DACNulCarB: W34/DACNulCarB/N (U5H.28), W34/DACNulCarB/C (U5G.28), W34/DACNulCarB/Tr1 (RT1D.10)
DACdataNC15_DACNulCarA: W12/DACNulCarA/N (U5B.27), W12/DACNulCarA/C (U5A.27), W12/DACNulCarA/Tr1 (RT1A.9)
DACdataNC15_DACNulCarA: W34/DACNulCarA/N (U5F.27), W34/DACNulCarA/C (U5E.27), W34/DACNulCarA/Tr1 (RT1C.9)
DACdataNC15_DACNulCarB: W12/DACNulCarB/N (U5D.27), W12/DACNulCarB/C (U5C.27), W12/DACNulCarB/Tr1 (RT1B.9)
DACdataNC15_DACNulCarB: W34/DACNulCarB/N (U5H.27), W34/DACNulCarB/C (U5G.27), W34/DACNulCarB/Tr1 (RT1D.9)
I2C.Reset: FMCPower (R66.2), W12/DACNulCarA (U8A.16), W12/DACNulCarB (U8B.16), W34/DACNulCarA (U8C.16), W34/DACNulCarB (U8D.16)
I2C.SCL: FMCio_rowsCDGH (P1.C30 R67.2 U15.6), W12/DACNulCarA (U8A.12), W12/DACNulCarB (U8B.12), W34/DACNulCarA (U8C.12), W34/DACNulCarB (U8D.12), TempSense (U22.1)
I2C.SDA: FMCio_rowsCDGH (P1.C31 R69.2 U15.5), W12/DACNulCarA (R38A.2 R42A.2 U8A.13), W12/DACNulCarB (R38B.2 R42B.2 U8B.13), W34/DACNulCarA (R38C.2 R42C.2 U8C.13), W34/DACNulCarB (R38D.2 R42D.2 U8D.13), TempSense (U22.6)
MezzPowerEnable: FMCio_rowsCDGH (R85.2 R86.1), W12/DACNulCarA (U10A.3 U11A.6), W12/DemodAB (U1A.3), W12/DACNulCarB (U10B.3 U11B.6), W34/DACNulCarA (U10C.3 U11C.6), W34/DemodAB (U1B.3), W34/DACNulCarB (U10D.3 U11D.6)
NetAmpN1A_1: W12/DACNulCarA/C (AmpN1A.1 C42A.1 R33A.2 U6A.1), W12/DACNulCarA/C/PR (R95A.2)
NetAmpN1B_1: W12/DACNulCarA/N (AmpN1B.1 C42B.1 R33B.2 U6B.1), W12/DACNulCarA/N/PR (R95B.2)
NetAmpN1C_1: W12/DACNulCarB/C (AmpN1C.1 C42C.1 R33C.2 U6C.1), W12/DACNulCarB/C/PR (R95C.2)
NetAmpN1D_1: W12/DACNulCarB/N (AmpN1D.1 C42D.1 R33D.2 U6D.1), W12/DACNulCarB/N/PR (R95D.2)
NetAmpN1E_1: W34/DACNulCarA/C (AmpN1E.1 C42E.1 R33E.2 U6E.1), W34/DACNulCarA/C/PR (R95E.2)
NetAmpN1F_1: W34/DACNulCarA/N (AmpN1F.1 C42F.1 R33F.2 U6F.1), W34/DACNulCarA/N/PR (R95F.2)
NetAmpN1G_1: W34/DACNulCarB/C (AmpN1G.1 C42G.1 R33G.2 U6G.1), W34/DACNulCarB/C/PR (R95G.2)
NetAmpN1H_1: W34/DACNulCarB/N (AmpN1H.1 C42H.1 R33H.2 U6H.1), W34/DACNulCarB/N/PR (R95H.2)
NetAmpP1A_1: W12/DACNulCarA/C (AmpP1A.1 C38A.1 R19A.2 U6A.7), W12/DACNulCarA/C/PR (R96A.2)
NetAmpP1B_1: W12/DACNulCarA/N (AmpP1B.1 C38B.1 R19B.2 U6B.7), W12/DACNulCarA/N/PR (R96B.2)
NetAmpP1C_1: W12/DACNulCarB/C (AmpP1C.1 C38C.1 R19C.2 U6C.7), W12/DACNulCarB/C/PR (R96C.2)
NetAmpP1D_1: W12/DACNulCarB/N (AmpP1D.1 C38D.1 R19D.2 U6D.7), W12/DACNulCarB/N/PR (R96D.2)
NetAmpP1E_1: W34/DACNulCarA/C (AmpP1E.1 C38E.1 R19E.2 U6E.7), W34/DACNulCarA/C/PR (R96E.2)
NetAmpP1F_1: W34/DACNulCarA/N (AmpP1F.1 C38F.1 R19F.2 U6F.7), W34/DACNulCarA/N/PR (R96F.2)
NetAmpP1G_1: W34/DACNulCarB/C (AmpP1G.1 C38G.1 R19G.2 U6G.7), W34/DACNulCarB/C/PR (R96G.2)
NetAmpP1H_1: W34/DACNulCarB/N (AmpP1H.1 C38H.1 R19H.2 U6H.7), W34/DACNulCarB/N/PR (R96H.2)
NetC105A_1: W12/DACNulCarA/N (C105A.1 R26B.1 R35B.1), W12/DACNulCarA/N/PR (R103B.1 U19B.5)
NetC105A_2: W12/DACNulCarA/N (C105A.2 R18B.1 R23B.1), W12/DACNulCarA/N/PR (R104B.2 U19B.8)
NetC105B_1: W12/DACNulCarA/C (C105B.1 R26A.1 R35A.1), W12/DACNulCarA/C/PR (R103A.1 U19A.5)
NetC105B_2: W12/DACNulCarA/C (C105B.2 R18A.1 R23A.1), W12/DACNulCarA/C/PR (R104A.2 U19A.8)
NetC105C_1: W12/DACNulCarB/N (C105C.1 R26D.1 R35D.1), W12/DACNulCarB/N/PR (R103D.1 U19D.5)
NetC105C_2: W12/DACNulCarB/N (C105C.2 R18D.1 R23D.1), W12/DACNulCarB/N/PR (R104D.2 U19D.8)
NetC105D_1: W12/DACNulCarB/C (C105D.1 R26C.1 R35C.1), W12/DACNulCarB/C/PR (R103C.1 U19C.5)
NetC105D_2: W12/DACNulCarB/C (C105D.2 R18C.1 R23C.1), W12/DACNulCarB/C/PR (R104C.2 U19C.8)
NetC105E_1: W34/DACNulCarA/N (C105E.1 R26F.1 R35F.1), W34/DACNulCarA/N/PR (R103F.1 U19F.5)
NetC105E_2: W34/DACNulCarA/N (C105E.2 R18F.1 R23F.1), W34/DACNulCarA/N/PR (R104F.2 U19F.8)
NetC105F_1: W34/DACNulCarA/C (C105F.1 R26E.1 R35E.1), W34/DACNulCarA/C/PR (R103E.1 U19E.5)
NetC105F_2: W34/DACNulCarA/C (C105F.2 R18E.1 R23E.1), W34/DACNulCarA/C/PR (R104E.2 U19E.8)
NetC105G_1: W34/DACNulCarB/N (C105G.1 R26H.1 R35H.1), W34/DACNulCarB/N/PR (R103H.1 U19H.5)
NetC105G_2: W34/DACNulCarB/N (C105G.2 R18H.1 R23H.1), W34/DACNulCarB/N/PR (R104H.2 U19H.8)
NetC105H_1: W34/DACNulCarB/C (C105H.1 R26G.1 R35G.1), W34/DACNulCarB/C/PR (R103G.1 U19G.5)
NetC105H_2: W34/DACNulCarB/C (C105H.2 R18G.1 R23G.1), W34/DACNulCarB/C/PR (R104G.2 U19G.8)
NO.DACout_N: MGMEZZ04 (J2.7), W34/DACNulCarB/N (R29H.2)
NO.DACout_N: MGMEZZ04 (J2.10), W34/DACNulCarA/N (R29F.2)
NO.DACout_N: MGMEZZ04 (J2.14), W12/DACNulCarB/N (R29D.2)
NO.DACout_N: MGMEZZ04 (J2.17), W12/DACNulCarA/N (R29B.2)
NO.DACout_P: MGMEZZ04 (J2.26), W34/DACNulCarB/N (R24H.2)
NO.DACout_P: MGMEZZ04 (J2.29), W34/DACNulCarA/N (R24F.2)
NO.DACout_P: MGMEZZ04 (J2.33), W12/DACNulCarB/N (R24D.2)
NO.DACout_P: MGMEZZ04 (J2.36), W12/DACNulCarA/N (R24B.2)
NullerClk_DACNulCarA: W12/DACNulCarA (R43A.2), W12/DACNulCarA/N (R34B.2 U5B.26)
NullerClk_DACNulCarA: W34/DACNulCarA (R43C.2), W34/DACNulCarA/N (R34F.2 U5F.26)
NullerClk_DACNulCarB: W12/DACNulCarB (R43B.2), W12/DACNulCarB/N (R34D.2 U5D.26)
NullerClk_DACNulCarB: W34/DACNulCarB (R43D.2), W34/DACNulCarB/N (R34H.2 U5H.26)
NulSwitchCtrl.SwitchCtrl0_DACNulCarA: W12/DACNulCarA (U8A.2), W12/DACNulCarA/N/PR (U18B.14 U18B.15)
NulSwitchCtrl.SwitchCtrl0_DACNulCarA: W34/DACNulCarA (U8C.2), W34/DACNulCarA/N/PR (U18F.14 U18F.15)
NulSwitchCtrl.SwitchCtrl0_DACNulCarB: W12/DACNulCarB (U8B.2), W12/DACNulCarB/N/PR (U18D.14 U18D.15)
NulSwitchCtrl.SwitchCtrl0_DACNulCarB: W34/DACNulCarB (U8D.2), W34/DACNulCarB/N/PR (U18H.14 U18H.15)
NulSwitchCtrl.SwitchCtrl1_DACNulCarA: W12/DACNulCarA (U8A.3), W12/DACNulCarA/N/PR (U18B.6 U18B.7)
NulSwitchCtrl.SwitchCtrl1_DACNulCarA: W34/DACNulCarA (U8C.3), W34/DACNulCarA/N/PR (U18F.6 U18F.7)
NulSwitchCtrl.SwitchCtrl1_DACNulCarB: W12/DACNulCarB (U8B.3), W12/DACNulCarB/N/PR (U18D.6 U18D.7)
NulSwitchCtrl.SwitchCtrl1_DACNulCarB: W34/DACNulCarB (U8D.3), W34/DACNulCarB/N/PR (U18H.6 U18H.7)
NulSwitchCtrl.SwitchCtrl2_DACNulCarA: W12/DACNulCarA (U8A.4), W12/DACNulCarA/N/PR (U19B.14 U19B.15)
NulSwitchCtrl.SwitchCtrl2_DACNulCarA: W34/DACNulCarA (U8C.4), W34/DACNulCarA/N/PR (U19F.14 U19F.15)
NulSwitchCtrl.SwitchCtrl2_DACNulCarB: W12/DACNulCarB (U8B.4), W12/DACNulCarB/N/PR (U19D.14 U19D.15)
NulSwitchCtrl.SwitchCtrl2_DACNulCarB: W34/DACNulCarB (U8D.4), W34/DACNulCarB/N/PR (U19H.14 U19H.15)
NulSwitchCtrl.SwitchCtrl3_DACNulCarA: W12/DACNulCarA (U8A.5), W12/DACNulCarA/N/PR (U19B.6 U19B.7)
NulSwitchCtrl.SwitchCtrl3_DACNulCarA: W34/DACNulCarA (U8C.5), W34/DACNulCarA/N/PR (U19F.6 U19F.7)
NulSwitchCtrl.SwitchCtrl3_DACNulCarB: W12/DACNulCarB (U8B.5), W12/DACNulCarB/N/PR (U19D.6 U19D.7)
NulSwitchCtrl.SwitchCtrl3_DACNulCarB: W34/DACNulCarB (U8D.5), W34/DACNulCarB/N/PR (U19H.6 U19H.7)
p3v3wrtLowerRail: FMCPower (C73.1 U14.9), U_FMCPower/BN (5 pins)
Squid_Power: MGMEZZ04 (J2.21), FMCio_rowsCDGH (P1.G36)
Squid_SCL: MGMEZZ04 (R82.2 R90.1 U16.5), FMCio_rowsCDGH (P1.H35)
Squid_SDA_MISO: MGMEZZ04 (R83.2), FMCio_rowsCDGH (P1.G31)
Squid_SDA_MOSI: MGMEZZ04 (R79.2 R89.1 U13.5), FMCio_rowsCDGH (P1.G30)
Vdd: W12/DACNulCarA (5 pins), W12/DACNulCarA/N (9 pins), W12/DACNulCarA/N/PR (6 pins), W12/DACNulCarA/C (9 pins), W12/DACNulCarA/C/PR (6 pins), W12/DemodAB (C1A.1 C2A.2 U2A.3)
Vdd: W12/DemodAB (C3A.2 C4A.1 U4A.3), W12/DACNulCarB (5 pins), W12/DACNulCarB/N (9 pins), W12/DACNulCarB/N/PR (6 pins), W12/DACNulCarB/C (9 pins), W12/DACNulCarB/C/PR (6 pins)
Vdd: W34/DACNulCarA (5 pins), W34/DACNulCarA/N (9 pins), W34/DACNulCarA/N/PR (6 pins), W34/DACNulCarA/C (9 pins), W34/DACNulCarA/C/PR (6 pins), W34/DemodAB (C1B.1 C2B.2 U2B.3)
Vdd: W34/DemodAB (C3B.2 C4B.1 U4B.3), W34/DACNulCarB (5 pins), W34/DACNulCarB/N (9 pins), W34/DACNulCarB/N/PR (6 pins), W34/DACNulCarB/C (9 pins), W34/DACNulCarB/C/PR (6 pins)
Vref: W12/DACNulCarA/N (C98B.2 R93A.1), W12/DACNulCarA/C (C98A.2 R93B.1), W12/DemodAB (R91A.2), W12/DACNulCarB/N (C98D.2 R93C.1), W12/DACNulCarB/C (C98C.2 R93D.1)
Vref: W34/DACNulCarA/N (C98F.2 R93E.1), W34/DACNulCarA/C (C98E.2 R93F.1), W34/DemodAB (R91B.2), W34/DACNulCarB/N (C98H.2 R93G.1), W34/DACNulCarB/C (C98G.2 R93H.1)
Vss: W12/DACNulCarA (C102A.2 R39A.1 U11A.3), W12/DACNulCarA/N (11 pins), W12/DACNulCarA/N/PR (8 pins), W12/DACNulCarA/C (11 pins), W12/DACNulCarA/C/PR (8 pins), W12/DemodAB (C9A.1 C10A.2 U2A.6)
Vss: W12/DemodAB (C11A.2 C12A.1 U4A.6), W12/DACNulCarB (C102B.2 R39B.1 U11B.3), W12/DACNulCarB/N (11 pins), W12/DACNulCarB/N/PR (8 pins), W12/DACNulCarB/C (11 pins), W12/DACNulCarB/C/PR (8 pins)
Vss: W34/DACNulCarA (C102C.2 R39C.1 U11C.3), W34/DACNulCarA/N (11 pins), W34/DACNulCarA/N/PR (8 pins), W34/DACNulCarA/C (11 pins), W34/DACNulCarA/C/PR (8 pins), W34/DemodAB (C9B.1 C10B.2 U2B.6)
Vss: W34/DemodAB (C11B.2 C12B.1 U4B.6), W34/DACNulCarB (C102D.2 R39D.1 U11D.3), W34/DACNulCarB/N (11 pins), W34/DACNulCarB/N/PR (8 pins), W34/DACNulCarB/C (11 pins), W34/DACNulCarB/C/PR (8 pins)